# Altium project pca10095.PrjPCB (part 5 of 5)
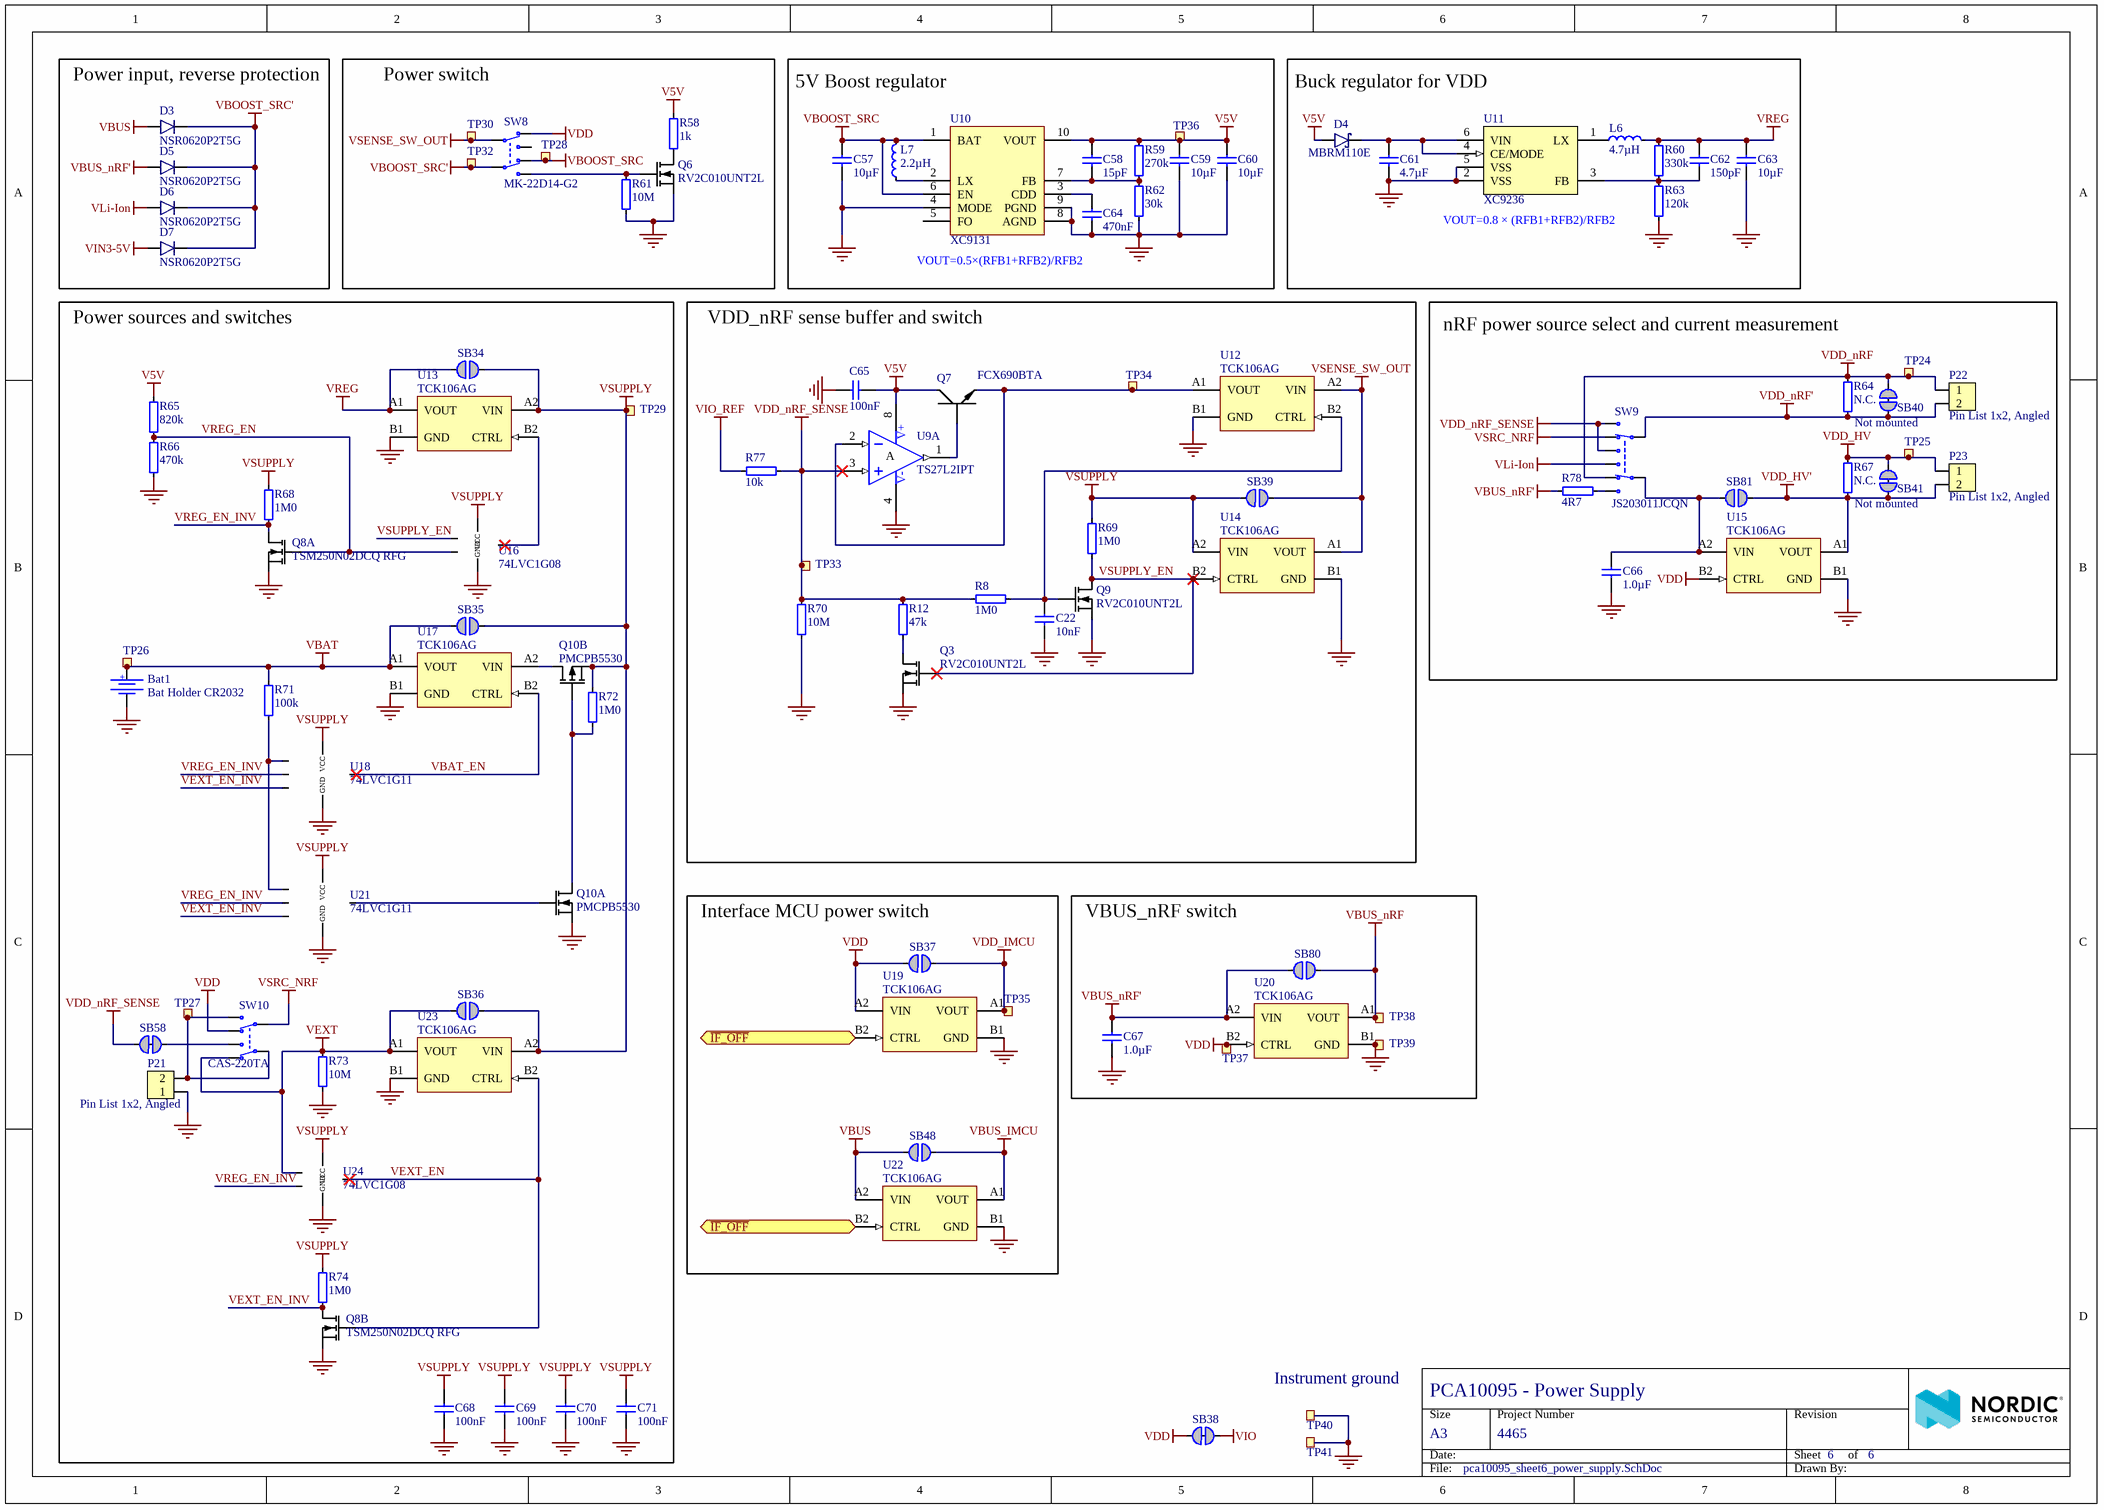
[diagram p6: pca10095_sheet6_power_supply.SchDoc]

## Nets that join several sheets
GND: pca10095_sheet2_nrf5340_mcu (34 pins), pca10095_sheet3_interface_mcu (33 pins), pca10095_sheet4_misc (28 pins), pca10095_sheet5_connectors (84 pins), pca10095_sheet6_power_supply (52 pins)
V5V: pca10095_sheet5_connectors (5 pins), pca10095_sheet6_power_supply (12 pins)
VBUS: pca10095_sheet3_interface_mcu (J4.5), pca10095_sheet4_misc (Q5.2 R52.1), pca10095_sheet5_connectors (C50.2 FB2.2), pca10095_sheet6_power_supply (D3.2 SB48.2 U22.A2)
VBUS_IMCU: pca10095_sheet3_interface_mcu (R7.2 R10.1), pca10095_sheet6_power_supply (SB48.1 U22.A1)
VBUS_nRF: pca10095_sheet2_nrf5340_mcu (R1.1), pca10095_sheet6_power_supply (SB80.1 TP38.1 U20.A1)
VBUS_nRF': pca10095_sheet5_connectors (C48.2 FB1.2), pca10095_sheet6_power_supply (5 pins)
VDD: pca10095_sheet4_misc (18 pins), pca10095_sheet5_connectors (R57.2 SB47.1 SB59.2), pca10095_sheet6_power_supply (8 pins)
VDD_HV: pca10095_sheet2_nrf5340_mcu (C20.1 U1.E1), pca10095_sheet5_connectors (P20.10 P26.10), pca10095_sheet6_power_supply (P23.1 R67.2 SB41.1 TP25.1)
VDD_HV': pca10095_sheet5_connectors (P20.11 P26.11), pca10095_sheet6_power_supply (5 pins)
VDD_IMCU: pca10095_sheet3_interface_mcu (30 pins), pca10095_sheet6_power_supply (SB37.1 TP35.1 U19.A1)
VDD_nRF: pca10095_sheet2_nrf5340_mcu (28 pins), pca10095_sheet4_misc (SB18.1), pca10095_sheet5_connectors (P20.1 P26.1), pca10095_sheet6_power_supply (5 pins)
VDD_nRF': pca10095_sheet5_connectors (P20.2 P26.2 SB60.2), pca10095_sheet6_power_supply (P22.2 R64.1 SB40.2 SW9.3)
VIN3-5V: pca10095_sheet5_connectors (P20.9 P26.9), pca10095_sheet6_power_supply (D7.2)
VIO: pca10095_sheet5_connectors (9 pins), pca10095_sheet6_power_supply (SB38.1)
VIO_REF: pca10095_sheet5_connectors (P20.12 P26.12 SB19.1), pca10095_sheet6_power_supply (R77.2)
VLi-Ion: pca10095_sheet5_connectors (J6.2 P27.2 TP31.1), pca10095_sheet6_power_supply (D6.2 SW9.5)
D_N: pca10095_sheet2_nrf5340_mcu (U1.B4), pca10095_sheet5_connectors (R53.1)
D_P: pca10095_sheet2_nrf5340_mcu (U1.B2), pca10095_sheet5_connectors (R54.1)
~{IF_OFF}: pca10095_sheet4_misc (8 pins), pca10095_sheet6_power_supply (U19.B2 U22.B2)
IMCU_BOOT: pca10095_sheet3_interface_mcu (U2.AL27), pca10095_sheet4_misc (SB46.2 U6.15)
IMCU_N: pca10095_sheet3_interface_mcu (U2.B4), pca10095_sheet5_connectors (D2.2 J2.2 TP10.1)
IMCU_P: pca10095_sheet3_interface_mcu (U2.B2), pca10095_sheet5_connectors (D2.3 J2.3 TP9.1)
MX25_~{CS}: pca10095_sheet2_nrf5340_mcu (SB13.2), pca10095_sheet4_misc (U7.1)
MX25_SCLK: pca10095_sheet2_nrf5340_mcu (SB11.2), pca10095_sheet4_misc (U7.6)
MX25_SIO0: pca10095_sheet2_nrf5340_mcu (SB12.2), pca10095_sheet4_misc (U7.5)
MX25_SIO1: pca10095_sheet2_nrf5340_mcu (SB14.2), pca10095_sheet4_misc (U7.2)
MX25_SIO2: pca10095_sheet2_nrf5340_mcu (SB15.2), pca10095_sheet4_misc (U7.3)
MX25_SIO3: pca10095_sheet2_nrf5340_mcu (SB10.2), pca10095_sheet4_misc (U7.7)
NetP1_3: pca10095_sheet4_misc (SB43.2 SB44.1 U6.4), pca10095_sheet5_connectors (5 pins)
NetP6_3: pca10095_sheet2_nrf5340_mcu (R42.1), pca10095_sheet5_connectors (P6.3 P12.3 P17.6)
NetP6_4: pca10095_sheet2_nrf5340_mcu (R45.1), pca10095_sheet5_connectors (P6.4 P12.4 P17.8)
NetP20_3: pca10095_sheet3_interface_mcu (Q2.1 R25.1), pca10095_sheet5_connectors (P20.3 P26.3)
NetP20_4: pca10095_sheet3_interface_mcu (R19.2), pca10095_sheet5_connectors (P20.4 P26.4)
NetP20_5: pca10095_sheet3_interface_mcu (R21.2), pca10095_sheet5_connectors (P20.5 P26.5)
NetP20_6: pca10095_sheet3_interface_mcu (R22.2), pca10095_sheet5_connectors (P20.6 P26.6)
NetP20_7: pca10095_sheet3_interface_mcu (R23.2), pca10095_sheet5_connectors (P20.7 P26.7)
NetP24_3: pca10095_sheet2_nrf5340_mcu (SB22.2), pca10095_sheet5_connectors (P24.3)
NetP24_4: pca10095_sheet2_nrf5340_mcu (SB24.2), pca10095_sheet5_connectors (P24.4)
NetP24_5: pca10095_sheet2_nrf5340_mcu (SB25.2), pca10095_sheet5_connectors (P24.5)
NetP24_6: pca10095_sheet2_nrf5340_mcu (SB20.2), pca10095_sheet5_connectors (P24.6)
NetP24_7: pca10095_sheet2_nrf5340_mcu (SB21.2), pca10095_sheet5_connectors (P24.7)
NetP24_8: pca10095_sheet2_nrf5340_mcu (SB23.2), pca10095_sheet5_connectors (P24.8)
NetR57_1: pca10095_sheet4_misc (U6.10), pca10095_sheet5_connectors (R57.1 SB33.2 TP19.1)
NFC1: pca10095_sheet4_misc (C43.1 R43.1), pca10095_sheet5_connectors (J5.2 TP17.1)
NFC2: pca10095_sheet4_misc (C44.2 R46.1), pca10095_sheet5_connectors (J5.4 TP18.1)
P0.00: pca10095_sheet2_nrf5340_mcu (SB3.2), pca10095_sheet5_connectors (P6.1 P12.1 P17.2)
P0.01: pca10095_sheet2_nrf5340_mcu (SB4.2), pca10095_sheet5_connectors (P6.2 P12.2 P17.4)
P0.02/NFC1: pca10095_sheet2_nrf5340_mcu (R42.2 U1.W1), pca10095_sheet4_misc (R43.2)
P0.03/NFC2: pca10095_sheet2_nrf5340_mcu (R45.2 U1.AA1), pca10095_sheet4_misc (R46.2)
P0.04/AIN0: pca10095_sheet2_nrf5340_mcu (U1.V2), pca10095_sheet5_connectors (P2.1 P8.1 P14.2 TP42.1)
P0.05/AIN1: pca10095_sheet2_nrf5340_mcu (U1.Y2), pca10095_sheet5_connectors (P2.2 P8.2 P14.4 TP43.1)
P0.06/AIN2: pca10095_sheet2_nrf5340_mcu (U1.AB2), pca10095_sheet5_connectors (P2.3 P8.3 P14.6 TP44.1)
P0.07/AIN3: pca10095_sheet2_nrf5340_mcu (U1.AD2), pca10095_sheet5_connectors (7 pins)
P0.08/TRACEDATA3: pca10095_sheet2_nrf5340_mcu (U1.AH2), pca10095_sheet4_misc (SW3.2), pca10095_sheet5_connectors (P6.6 P12.6 P17.12 P25.20)
P0.09/TRACEDATA2: pca10095_sheet2_nrf5340_mcu (U1.AJ1), pca10095_sheet4_misc (SW4.2), pca10095_sheet5_connectors (P6.7 P12.7 P17.14 P25.18)
P0.10/TRACEDATA1: pca10095_sheet2_nrf5340_mcu (U1.AK2), pca10095_sheet4_misc (SB27.1), pca10095_sheet5_connectors (P6.8 P12.8 P17.16 P25.16)
P0.11/TRACEDATA0: pca10095_sheet2_nrf5340_mcu (U1.AK4), pca10095_sheet4_misc (SB28.1 SB57.1), pca10095_sheet5_connectors (P18.6 P24.1 P25.6 P25.14)
P0.12/TRACECLK: pca10095_sheet2_nrf5340_mcu (U1.AK6), pca10095_sheet5_connectors (P24.2 P25.12)
P0.19: pca10095_sheet2_nrf5340_mcu (U1.AL13), pca10095_sheet4_misc (SB51.1), pca10095_sheet5_connectors (P24.9)
P0.20: pca10095_sheet2_nrf5340_mcu (U1.AK16), pca10095_sheet4_misc (SB53.1), pca10095_sheet5_connectors (P24.10)
P0.21: pca10095_sheet2_nrf5340_mcu (U1.AL15), pca10095_sheet4_misc (SB50.1), pca10095_sheet5_connectors (P24.11)
P0.22: pca10095_sheet2_nrf5340_mcu (U1.AK18), pca10095_sheet4_misc (SB52.1), pca10095_sheet5_connectors (P24.12)
P0.23: pca10095_sheet2_nrf5340_mcu (U1.AK20), pca10095_sheet4_misc (SW1.2), pca10095_sheet5_connectors (P24.13)
P0.24: pca10095_sheet2_nrf5340_mcu (U1.AL27), pca10095_sheet4_misc (SW2.2), pca10095_sheet5_connectors (P24.14)
P0.25/AIN4: pca10095_sheet2_nrf5340_mcu (U1.AK28), pca10095_sheet5_connectors (P2.5 P8.5 P14.10 TP46.1)
P0.26/AIN5: pca10095_sheet2_nrf5340_mcu (U1.AL29), pca10095_sheet5_connectors (P2.6 P8.6 P14.12 TP47.1)
P0.27/AIN6: pca10095_sheet2_nrf5340_mcu (U1.AK30), pca10095_sheet5_connectors (P4.8 P10.8 P16.16)
P0.28/AIN7: pca10095_sheet2_nrf5340_mcu (U1.AE31), pca10095_sheet4_misc (SB5.1), pca10095_sheet5_connectors (P24.15)
P0.29: pca10095_sheet2_nrf5340_mcu (U1.U31), pca10095_sheet4_misc (SB6.1), pca10095_sheet5_connectors (P24.16)
P0.30: pca10095_sheet2_nrf5340_mcu (U1.B24), pca10095_sheet4_misc (SB7.1), pca10095_sheet5_connectors (P24.17)
P0.31: pca10095_sheet2_nrf5340_mcu (U1.B22), pca10095_sheet4_misc (SB8.1), pca10095_sheet5_connectors (P24.18)
P1.00: pca10095_sheet2_nrf5340_mcu (U1.M2), pca10095_sheet4_misc (SB29.1), pca10095_sheet5_connectors (P3.1 P9.1 P15.2)
P1.01: pca10095_sheet2_nrf5340_mcu (U1.P2), pca10095_sheet4_misc (SB30.1), pca10095_sheet5_connectors (P3.2 P9.2 P15.4)
P1.02: pca10095_sheet2_nrf5340_mcu (R20.1), pca10095_sheet4_misc (U6.8), pca10095_sheet5_connectors (P4.9 P10.9 P16.18)
P1.03: pca10095_sheet2_nrf5340_mcu (R24.1), pca10095_sheet4_misc (U6.12), pca10095_sheet5_connectors (P4.10 P10.10 P16.20)
P1.04: pca10095_sheet2_nrf5340_mcu (U1.AL19), pca10095_sheet5_connectors (P3.3 P9.3 P15.6)
P1.05: pca10095_sheet2_nrf5340_mcu (U1.AK22), pca10095_sheet5_connectors (P3.4 P9.4 P15.8)
P1.06: pca10095_sheet2_nrf5340_mcu (U1.AL21), pca10095_sheet5_connectors (P3.5 P9.5 P15.10)
P1.07: pca10095_sheet2_nrf5340_mcu (U1.AK24), pca10095_sheet5_connectors (P3.6 P9.6 P15.12)
P1.08: pca10095_sheet2_nrf5340_mcu (U1.AL23), pca10095_sheet5_connectors (P3.7 P9.7 P15.14)
P1.09: pca10095_sheet2_nrf5340_mcu (U1.AK26), pca10095_sheet5_connectors (P3.8 P9.8 P15.16)
P1.10: pca10095_sheet2_nrf5340_mcu (U1.R31), pca10095_sheet5_connectors (P4.1 P10.1 P16.2)
P1.11: pca10095_sheet2_nrf5340_mcu (U1.B20), pca10095_sheet5_connectors (P4.2 P10.2 P16.4)
P1.12: pca10095_sheet2_nrf5340_mcu (U1.B18), pca10095_sheet5_connectors (P4.3 P10.3 P16.6)
P1.13: pca10095_sheet2_nrf5340_mcu (U1.A17), pca10095_sheet5_connectors (5 pins)
P1.14: pca10095_sheet2_nrf5340_mcu (U1.B16), pca10095_sheet5_connectors (5 pins)
P1.15: pca10095_sheet2_nrf5340_mcu (U1.B14), pca10095_sheet5_connectors (5 pins)
~{RESET}: pca10095_sheet2_nrf5340_mcu (U1.AC31), pca10095_sheet4_misc (SB42.2 SB44.2 SB45.2 SB56.1), pca10095_sheet5_connectors (P18.10 P25.10)
SWD0_RESET': pca10095_sheet3_interface_mcu (R17.2), pca10095_sheet5_connectors (P19.10)
SWD0_SEL: pca10095_sheet3_interface_mcu (U2.B24), pca10095_sheet5_connectors (P19.3)
SWD0_SWDCLK: pca10095_sheet3_interface_mcu (R15.2), pca10095_sheet5_connectors (P19.4)
SWD0_SWDIO: pca10095_sheet3_interface_mcu (R14.2), pca10095_sheet5_connectors (P19.2)
SWD0_SWO': pca10095_sheet3_interface_mcu (R16.2), pca10095_sheet5_connectors (P19.6)
SWD3_CLK: pca10095_sheet3_interface_mcu (U2.R1), pca10095_sheet4_misc (TP6.1 U5.3)
SWD3_IO: pca10095_sheet3_interface_mcu (U2.N1), pca10095_sheet4_misc (TP5.1 U5.15)
SWD3_RESET: pca10095_sheet3_interface_mcu (U2.AA1), pca10095_sheet4_misc (TP7.1 U5.7)
SWD3_SWO: pca10095_sheet3_interface_mcu (U2.W1), pca10095_sheet4_misc (TP8.1 U5.11)
SWDCLK: pca10095_sheet2_nrf5340_mcu (U1.W31), pca10095_sheet4_misc (SB55.1), pca10095_sheet5_connectors (P18.4 P25.4)
SWDIO: pca10095_sheet2_nrf5340_mcu (U1.AA31), pca10095_sheet4_misc (SB54.1), pca10095_sheet5_connectors (P18.2 P25.2)
VCOM0_CTS: pca10095_sheet3_interface_mcu (R9.1 U2.AL9), pca10095_sheet4_misc (TP55.1 U25.4)
VCOM0_RTS: pca10095_sheet3_interface_mcu (U2.AL5), pca10095_sheet4_misc (TP54.1 U25.16)
VCOM0_RXD: pca10095_sheet3_interface_mcu (U2.AL19), pca10095_sheet4_misc (TP57.1 U25.11)
VCOM0_TXD: pca10095_sheet3_interface_mcu (U2.U31), pca10095_sheet4_misc (TP56.1 U25.7)
VCOM2_CTS: pca10095_sheet3_interface_mcu (R13.1 U2.AL15), pca10095_sheet4_misc (TP1.1 U3.4)
VCOM2_RTS: pca10095_sheet3_interface_mcu (U2.AL13), pca10095_sheet4_misc (TP3.1 U3.16)
VCOM2_RxD: pca10095_sheet3_interface_mcu (U2.AL21), pca10095_sheet4_misc (TP2.1 U3.11)
VCOM2_TxD: pca10095_sheet3_interface_mcu (U2.AL23), pca10095_sheet4_misc (TP4.1 U3.7)